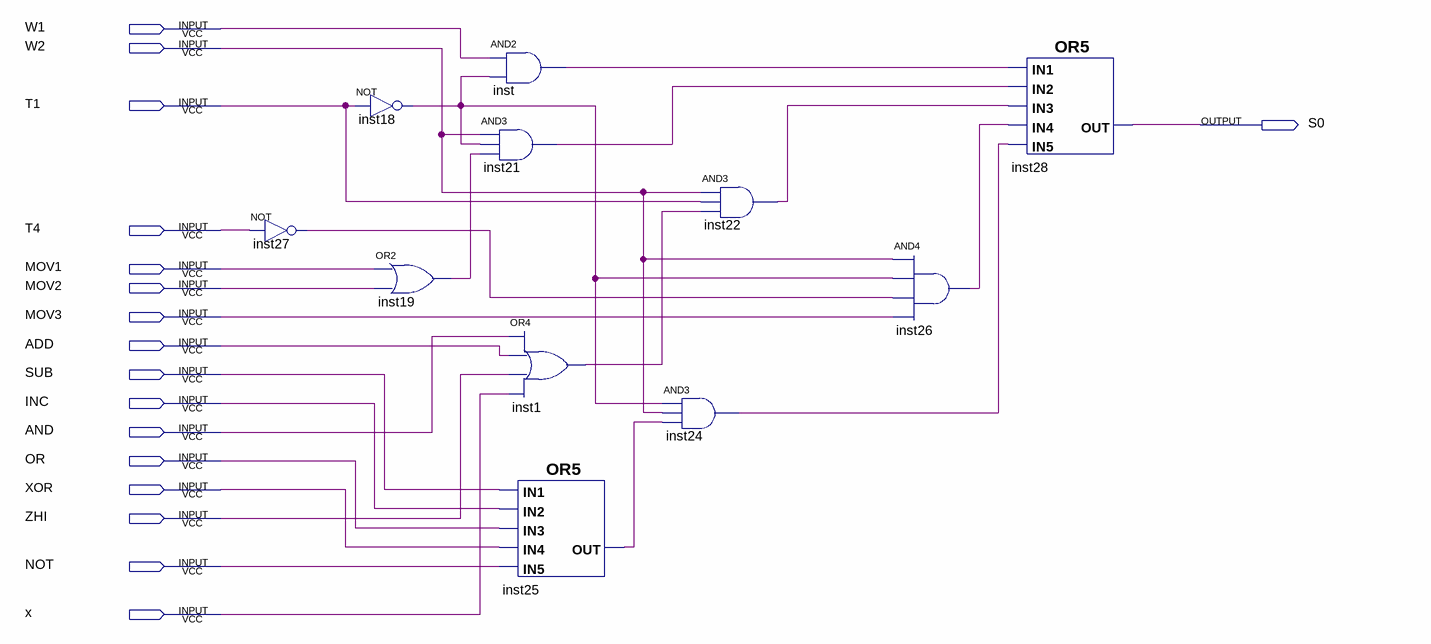
[diagram p0: schematic sheet]
// Quartus schematic S0.bdf as structural Verilog: 11 symbols, 17 pins
module S0 (
  input  W1,
  input  W2,
  input  T1,
  input  T4,
  input  MOV1,
  input  MOV2,
  input  MOV3,
  input  ADD,
  input  SUB,
  input  INC,
  input  AND,
  input  OR,
  input  XOR,
  input  ZHI,
  input  NOT,
  input  x,
  output S0
);

  wire inst1_out, inst18_out, inst19_out, inst21_out, inst22_out, inst24_out, inst25_out, inst26_out,
       inst27_out, inst_out;

  not inst27 (inst27_out, T4);
  not inst18 (inst18_out, T1);
  or inst19 (inst19_out, MOV1, MOV2);
  and inst (inst_out, W1, inst18_out);
  and inst21 (inst21_out, W2, inst18_out, inst19_out);
  or inst1 (inst1_out, AND, ADD, ZHI, x);
  or inst25 (inst25_out, SUB, INC, OR, XOR, NOT);
  and inst22 (inst22_out, W2, T1, inst1_out);
  and inst24 (inst24_out, inst18_out, W2, inst25_out);
  and inst26 (inst26_out, W2, inst18_out, inst27_out, MOV3);
  or inst28 (S0, inst_out, inst21_out, inst22_out, inst26_out, inst24_out);
endmodule
